# Altium schematic sheet FDCAN.SchDoc
size 209 x 148 mm; SheetNumber: 5; SheetTotal: 5
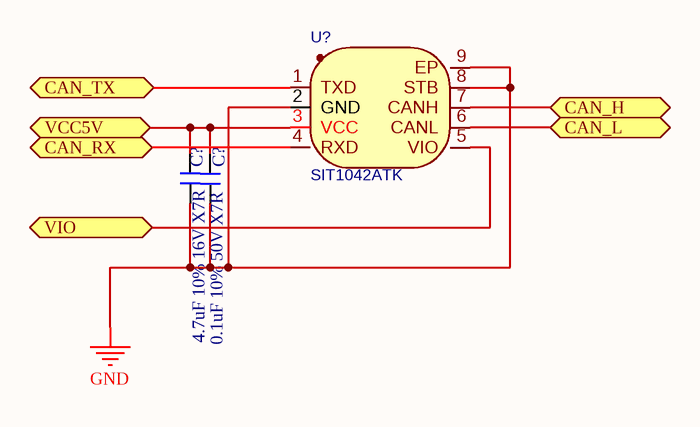
[diagram p0: FDCAN.SchDoc]

## Parts
(Parts that share a designator on the sheet are numbered #1, #2 ... from top to bottom, then left to right.)
C?#1  4.7uF 10% 16V X7R  [C 0603_L]
C?#2  0.1uF 10% 50V X7R  [C 0603_L]
U?  SIT1042ATK  [TDFN-8_L3.0-W3.0-P0.65-BL-EP]

## Ports
CAN_H (bidir, see Pipeline Robots[1B]), CAN_L (bidir, see Pipeline Robots[1B]), CAN_RX (bidir, see Pipeline Robots[2B]), CAN_TX (bidir, see Pipeline Robots[2B]), VCC5V (bidir, see Pipeline Robots[2B]), VIO (bidir, see Pipeline Robots[2B])

## Nets
GND: C?#1.2 C?#2.1 U?.2(GND) U?.8(STB) U?.9(EP)
CAN_H: U?.7(CANH) ; port CAN_H
CAN_L: U?.6(CANL) ; port CAN_L
CAN_RX: U?.4(RXD) ; port CAN_RX
CAN_TX: U?.1(TXD) ; port CAN_TX
VCC5V: C?#1.1 C?#2.2 U?.3(VCC) ; port VCC5V
VIO: U?.5(VIO) ; port VIO

## Library data of the parts
C?#1 C?#2 = C: 贴片电容
U? = SIT1042ATK: BOM_Manufacturer: SIT; BOM_Manufacturer Part: SIT1050TK; Contributor: LCSC; BOM_Supplier: LCSC; BOM_Supplier Part: C427444; BOM_JLCPCB Part Class: Extended Part; spicePre: U; spiceSymbolName: SIT1050TK